# Altium schematic sheet Mag_Enc_Sensors_muxed.SchDoc
size Letter; SheetNumber: 7; SheetTotal: 8
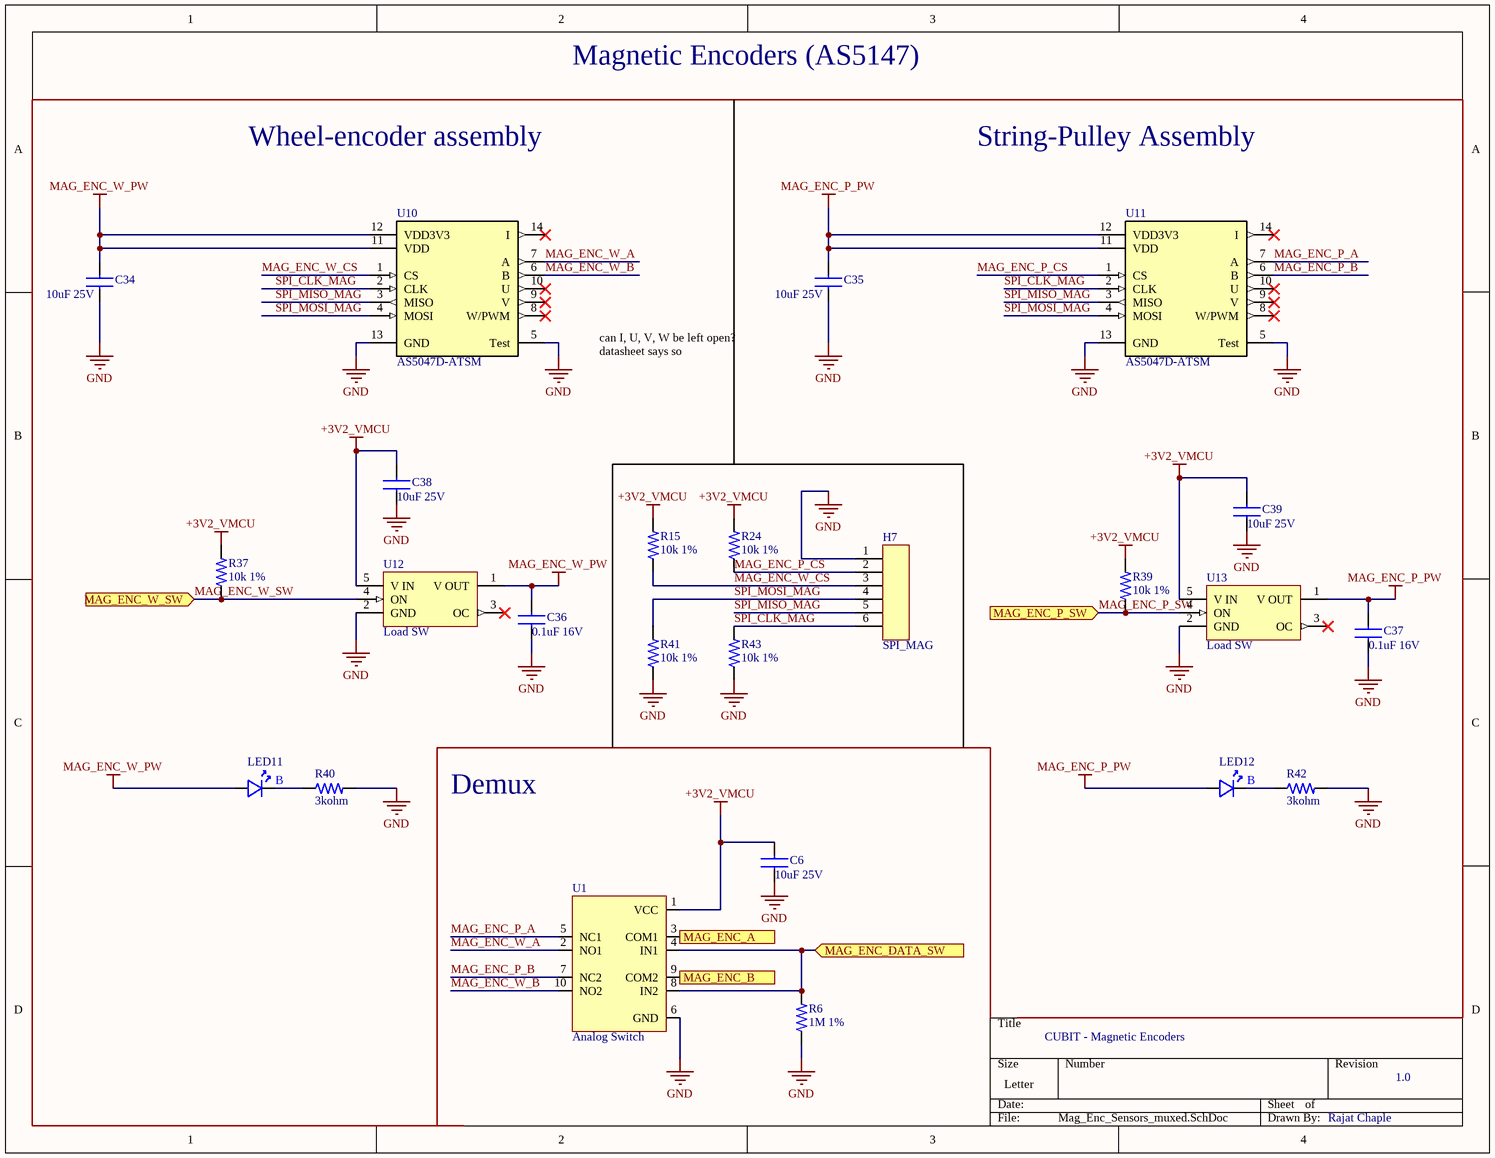
[diagram p0: Mag_Enc_Sensors_muxed.SchDoc]

## Parts
C6  10uF 25V  [CAP_0805_02X125]
C34  10uF 25V  [CAP_0805_02X125]
C35  10uF 25V  [CAP_0805_02X125]
C36  0.1uF 16V  [CAP_0603_1MM]
C37  0.1uF 16V  [CAP_0603_1MM]
C38  10uF 25V  [CAP_0805_02X125]
C39  10uF 25V  [CAP_0805_02X125]
H7  SPI_MAG  [6_PIN_100MIL]
LED11  150060BS75000  [LED_0603_RED_WL-SMCW]  (value not drawn)
LED12  150060BS75000  [LED_0603_RED_WL-SMCW]  (value not drawn)
R6  1M 1%  [2_Chip_0603_RMCF]
R15  10k 1%  [2_Chip_0603_RMCF]
R24  10k 1%  [2_Chip_0603_RMCF]
R37  10k 1%  [2_Chip_0603_RMCF]
R39  10k 1%  [2_Chip_0603_RMCF]
R40  3kohm  [CAP_0603_1MM]
R41  10k 1%  [2_Chip_0603_RMCF]
R42  3kohm  [CAP_0603_1MM]
R43  10k 1%  [2_Chip_0603_RMCF]
U1  Analog Switch  [TSSOP50P490X110-10N]
U10  AS5047D-ATSM  [14-TSOP_5x4_4]
U11  AS5047D-ATSM  [14-TSOP_5x4_4]
U12  Load SW  [SOT65P210X110-5N]
U13  Load SW  [SOT65P210X110-5N]

## Ports
MAG_ENC_A (out), MAG_ENC_B (out), MAG_ENC_DATA_SW (in), MAG_ENC_P_SW (in), MAG_ENC_W_SW (in)

## Nets
+3V2_VMCU: C6.1 C38.1 C39.1 R15.2 R24.2 R37.2 R39.2 U1.1(VCC) U12.5(V_IN) U13.5(V_IN)
GND: C6.2 C34.2 C35.2 C36.2 C37.2 C38.2 C39.2 H7.1 R6.1 R40.2 R41.1 R42.2 R43.1 U1.6(GND) U10.5(Test) U10.13(GND) U11.5(Test) U11.13(GND) U12.2(GND) U13.2(GND)
MAG_ENC_P_PW: C35.1 C37.1 LED12.A U11.11(VDD) U11.12(VDD3V3) U13.1(V_OUT)
MAG_ENC_W_PW: C34.1 C36.1 LED11.A U10.11(VDD) U10.12(VDD3V3) U12.1(V_OUT)
MAG_ENC_A: U1.3(COM1) ; port MAG_ENC_A
MAG_ENC_B: U1.9(COM2) ; port MAG_ENC_B
MAG_ENC_DATA_SW: R6.2 U1.4(IN1) U1.8(IN2) ; port MAG_ENC_DATA_SW
MAG_ENC_P_A: U1.5(NC1) U11.7(A)
MAG_ENC_P_B: U1.7(NC2) U11.6(B)
MAG_ENC_P_CS: H7.2 R24.1 U11.1(CS)
MAG_ENC_P_SW: R39.1 U13.4(ON) ; port MAG_ENC_P_SW
MAG_ENC_W_A: U1.2(NO1) U10.7(A)
MAG_ENC_W_B: U1.10(NO2) U10.6(B)
MAG_ENC_W_CS: H7.3 R15.1 U10.1(CS)
MAG_ENC_W_SW: R37.1 U12.4(ON) ; port MAG_ENC_W_SW
SPI_CLK_MAG: H7.6 R43.2 U10.2(CLK) U11.2(CLK)
SPI_MISO_MAG: H7.5 U10.3(MISO) U11.3(MISO)
SPI_MOSI_MAG: H7.4 R41.2 U10.4(MOSI) U11.4(MOSI)
NetLED11_C: LED11.C R40.1
NetLED12_C: LED12.C R42.1

Not connected (* = marked no-connect by the designer): U10 8(W/PWM)* 9(V)* 10(U)* 14(I)*; U11 8(W/PWM)* 9(V)* 10(U)* 14(I)*; U12 3(OC)*; U13 3(OC)*

## Notes on the sheet
- Magnetic Encoders (AS5147)
- Wheel-encoder assembly
- String-Pulley Assembly
- can I, U, V, W be left open?
  datasheet says so
- Demux
- CUBIT - Magnetic Encoders
- 1.0
- Rajat Chaple
- (in symbol 150060BS75000) B

## Library data of the parts
C6 C34 C35 C38 C39 = GRM21BR61E106KA73K: Cap 0805 25 V 10 uF ±20% Tolerance X5R Monolithic Ceramic Chip Capacitor; Manufacturer: Murata; Tolerance: 10%; Supplier 1: Digi-Key; Manufacturer Part Number: GRM21BR61E106KA73K; RoHS: Yes; Category: Ceramic Capacitors; Stock 1: 1875; Pricing 1: 1=0.23000, 10=0.15700, 50=0.09400, 100=0.07940, 500=0.05434, 1000=0.04807, 2500=0.04598, 5000=0.04180 (USD); Mount: Surface Mount; Case/Package: 0805; Weight: 0.000335oz; Min Operating Temperature: -55°C; Max Operating Temperature: 85°C; Packaging: Tape and Reel; Capacitance: 10uF; Voltage Rating: 25V; Package Quantity: 10000; Dielectric: X5R; Voltage Rating (DC): 25V; Length: 0.079inch; Width: 0.049inch; Thickness: 0.055inch; RoHS Compliant: Yes; ComponentLink1URL: http://www.mouser.com/ds/2/281/c02e-2905.pdf?src-supplier=Mouser; ComponentLink1Description: http://www.mouser.com/ds/2/281/c02e-2905.pdf?src-supplier=Mouser; ComponentLink2URL: http://search.murata.co.jp/Ceramy/image/img/A01X/G101/ENG/GRM21BR61E106KA73-01.pdf?src-supplier=Digi-Key; ComponentLink2Description: http://search.murata.co.jp/Ceramy/image/img/A01X/G101/ENG/GRM21BR61E106KA73-01.pdf?src-supplier=Digi-Key; ComponentLink3URL: https://search.murata.co.jp/Ceramy/image/img/A01X/G101/ENG/GRM21BR61E106KA73-01.pdf?src-supplier=Digi-Key; ComponentLink3Description: https://search.murata.co.jp/Ceramy/image/img/A01X/G101/ENG/GRM21BR61E106KA73-01.pdf?src-supplier=Digi-Key
C36 C37 = C0805C104K4RACAUTO: Cap Ceramic 0.1uF 16V X7R 10% SMD 0603 125°C Paper T/R; Manufacturer: KEMET; Capacitance: 100nF; Supplier 1: Digi-Key; Manufacturer Part Number: C0805C104K4RACAUTO; RoHS: Yes; Category: Ceramic Capacitors; Stock 1: 15900; Pricing 1: 1=0.24000, 10=0.16200, 50=0.09700, 100=0.08190, 500=0.05606, 1000=0.04959 (USD); Case/Package: 0805; Min Operating Temperature: -55°C; Max Operating Temperature: 125°C; Tolerance: 10%; Packaging: Tape and Reel; Dielectric: X7R; Length: 2mm; Depth: 1.25mm; RoHS Compliant: Yes; ComponentLink1URL: http://components.arrow.com/part/dataview/0323_00325188?src-supplier=Arrow+Europe; ComponentLink1Description: http://components.arrow.com/part/dataview/0323_00325188?src-supplier=Arrow+Europe
H7 = 6_pin_connector
LED11 LED12 = 150060BS75000: Led, Blue, 470 Nm, 3.2 V, 30 Ma, 145 Mcd Rohs Compliant: Yes; Manufacturer: Wurth Electronics; Luminous Intensity: 145mcd; Forward Current: 30mA; Forward Voltage: 3.2V; Wavelength: 470nm; Viewing Angle: 140°; Lens Style: Clear,Rectangular; Test Current: 20mA; Supplier 1: Digi-Key; Manufacturer Part Number: 150060BS75000; RoHS: Yes; Category: LEDs; Stock 1: 351; Pricing 1: 1=0.16000, 50=0.15000, 100=0.12900, 500=0.11200 (USD); Mount: Surface Mount; Case/Package: 0603; Color: Blue; Case Code (Metric): 1608; Case Code (Imperial): 0603; Min Operating Temperature: -40°C; Max Operating Temperature: 85°C; Package Quantity: 4000; Packaging: Cut Tape; Dominant Wavelength: 470nm; Length: 1.6mm; Width: 0.8mm; Height: 0.7mm; REACH SVHC: Unknown; RoHS Compliant: Yes; ComponentLink1URL: https://datasheet.ciiva.com/29563/150060bs75000-29563034.pdf?src-supplier=Digi-Key; ComponentLink1Description: https://datasheet.ciiva.com/29563/150060bs75000-29563034.pdf?src-supplier=Digi-Key; ComponentLink2URL: https://datasheet.ciiva.com/29279/759426-da-01-en-chipled-0603-w-kl-blau-150060bs75000-29279193.pdf?src-supplier=Conrad; ComponentLink2Description: https://datasheet.ciiva.com/29279/759426-da-01-en-chipled-0603-w-kl-blau-150060bs75000-29279193.pdf?src-supplier=Conrad; ComponentLink3URL: https://datasheet.ciiva.com/29563/150060bs75000-29563036.pdf?src-supplier=Digi-Key; ComponentLink3Description: https://datasheet.ciiva.com/29563/150060bs75000-29563036.pdf?src-supplier=Digi-Key; ComponentLink4URL: https://datasheet.ciiva.com/29563/150060bs75000-29563035.pdf?src-supplier=Digi-Key; ComponentLink4Description: https://datasheet.ciiva.com/29563/150060bs75000-29563035.pdf?src-supplier=Digi-Key; ComponentLink5URL: https://datasheet.ciiva.com/22656/1911343-22656939.pdf?src-supplier=Element14; ComponentLink5Description: https://datasheet.ciiva.com/22656/1911343-22656939.pdf?src-supplier=Element14; ComponentLink6URL: https://datasheet.ciiva.com/48430/150060bs75000-eng-tds-48430039.pdf?src-supplier=Distrelec; ComponentLink6Description: https://datasheet.ciiva.com/48430/150060bs75000-eng-tds-48430039.pdf?src-supplier=Distrelec
R6 = RMCF0603FT1M00: Res 1M Ohm 1% 1/10W ±100ppm/°C Molded SMD Paper T/R; Manufacturer: Stackpole Electronics; Resistance: 1MR; Power Rating: 100mW; Working Voltage: 75V; Supplier 1: Digi-Key; Manufacturer Part Number: RMCF0603FT1M00; RoHS: Yes; Category: Chip SMD Resistors; Stock 1: 2136203; Pricing 1: 1=0.10000, 10=0.01700, 100=0.00680, 1000=0.00305, 2500=0.00264 (USD); Mount: Surface Mount; Case/Package: 0603; Case Code (Metric): 1608; Case Code (Imperial): 0603; Contact Plating: Tin,Matte; Min Operating Temperature: -55°C; Max Operating Temperature: 155°C; Tolerance: 1%; Packaging: Tape and Reel; Resistor Type: Thick Film; Number of Terminations: 2; Max Power Dissipation: 100mW; Temperature Coefficient: 100ppm/°C; Features: Automotive AEC-Q200; Series: RMCF; Construction: Rectangular; Technology: THICK FILM; Length: 1.55mm; Width: 0.031inch; Height: 0.022inch; Depth: 0.8mm; Radiation Hardening: No; Military Standard: Not; Lead Free: Lead Free; RoHS Compliant: Yes; ComponentLink1URL: https://datasheet.ciiva.com/15193/getdatasheetpartid-363151-15193451.pdf?src-supplier=Verical; ComponentLink1Description: https://datasheet.ciiva.com/15193/getdatasheetpartid-363151-15193451.pdf?src-supplier=Verical
R15 R24 R37 R39 R41 R43 = RMCF0603FT10K0: Res 10K Ohm 1% 1/10W ±100ppm/°C Molded SMD SMD Paper T/R; Manufacturer: Stackpole Electronics; Resistance: 10kR; Power Rating: 100mW; Supplier 1: Digi-Key; Manufacturer Part Number: RMCF0603FT10K0; RoHS: Yes; Category: Chip SMD Resistors; Stock 1: 15114443; Pricing 1: 5000=0.00218 (USD); Mount: Surface Mount; Case/Package: 0603; Case Code (Metric): 1608; Case Code (Imperial): 0603; Contact Plating: Tin,Matte; Size Code: 0603; Min Operating Temperature: -55°C; Max Operating Temperature: 155°C; Tolerance: 1%; Packaging: Tape and Reel; Resistor Type: Thick Film; Number of Terminations: 2; Max Power Dissipation: 100mW; Temperature Coefficient: 100ppm/°C; Features: Automotive AEC-Q200; Series: RMCF; Construction: Rectangular; Length: 1.55mm; Width: 0.031inch; Height: 0.022inch; Depth: 0.8mm; Radiation Hardening: No; Military Standard: Not; Lead Free: Lead Free; RoHS Compliant: Yes; ComponentLink1URL: http://components.arrow.com/part/dataview/43747082S6756917N1174?src-supplier=Arrow+Electronics; ComponentLink1Description: http://components.arrow.com/part/dataview/43747082S6756917N1174?src-supplier=Arrow+Electronics; ComponentLink2URL: https://www.seielect.com/catalog/SEI-RMCF_RMCP.pdf?src-supplier=Avnet; ComponentLink2Description: https://www.seielect.com/catalog/SEI-RMCF_RMCP.pdf?src-supplier=Avnet; ComponentLink3URL: http://www.seielect.com/catalog/sei-rmc.pdf?src-supplier=Future+Electronics; ComponentLink3Description: http://www.seielect.com/catalog/sei-rmc.pdf?src-supplier=Future+Electronics; ComponentLink4URL: https://www.verical.com/server-webapp/html/getDatasheet?partID=360913&src-supplier=Verical; ComponentLink4Description: https://www.verical.com/server-webapp/html/getDatasheet?partID=360913&src-supplier=Verical; ComponentLink5URL: https://www.seielect.com/catalog/sei-rmcf_rmcp.pdf?src-supplier=Digi-Key; ComponentLink5Description: https://www.seielect.com/catalog/sei-rmcf_rmcp.pdf?src-supplier=Digi-Key
R40 R42 = RC0603FR-073KL: Res 3000Ω ± 1.00% 0.1W ± 100ppm/℃ 0603; Manufacturer: Yageo; Tolerance: 1%; Resistance: 3kR; Power Rating: 100mW; Voltage Rating: 50V; Temperature Coefficient: 100ppm/°C; Supplier 1: Digi-Key; Manufacturer Part Number: RC0603FR-073KL; RoHS: Yes; Category: Chip SMD Resistors; Stock 1: 1079123; Pricing 1: 1=0.10000, 10=0.02400, 100=0.00970, 1000=0.00436, 2500=0.00378 (USD); Case/Package: 0603; Number of Pins: 2; Case Code (Imperial): 0603; Case Code (Metric): 1608; Size Code: 0603; Min Operating Temperature: -55°C; Max Operating Temperature: 155°C; Packaging: Tape and Reel; Termination: SMD/SMT; Resistor Type: Thick Film; Voltage Rating (DC): 50V; Features: Moisture Resistant; Series: RC; Max Power Dissipation: 100mW; Number of Terminations: 2; Construction: Rectangular; Resistance Tolerance: 1%; Length: 1.6mm; Width: 800um; Depth: 0.8mm; Military Standard: Not; Lead Free: Lead Free; RoHS Compliant: Yes; REACH SVHC: No SVHC; ComponentLink1URL: http://www.farnell.com/datasheets/2167052.pdf?src-supplier=Farnell; ComponentLink1Description: http://www.farnell.com/datasheets/2167052.pdf?src-supplier=Farnell; ComponentLink2URL: http://www.mouser.com/ds/2/447/RC0603-272842.pdf?src-supplier=Mouser; ComponentLink2Description: http://www.mouser.com/ds/2/447/RC0603-272842.pdf?src-supplier=Mouser; ComponentLink3URL: http://components.arrow.com/part/dataview/0323_00200942?src-supplier=Arrow+Europe; ComponentLink3Description: http://components.arrow.com/part/dataview/0323_00200942?src-supplier=Arrow+Europe; ComponentLink4URL: https://www.verical.com/server-webapp/html/getDatasheet?partID=135099&src-supplier=Verical; ComponentLink4Description: https://www.verical.com/server-webapp/html/getDatasheet?partID=135099&src-supplier=Verical; ComponentLink5URL: http://www.farnell.com/datasheets/2167052.pdf?src-supplier=Element14; ComponentLink5Description: http://www.farnell.com/datasheets/2167052.pdf?src-supplier=Element14; ComponentLink6URL: http://www.yageo.com/documents/recent/PYu-RC_Group_51_RoHS_L_10.pdf?src-supplier=Digi-Key; ComponentLink6Description: http://www.yageo.com/documents/recent/PYu-RC_Group_51_RoHS_L_10.pdf?src-supplier=Digi-Key; ComponentLink7URL: http://www.yageo.com/documents/recent/PYu-RC_Group_51_RoHS_L_9.pdf?src-supplier=Digi-Key; ComponentLink7Description: http://www.yageo.com/documents/recent/PYu-RC_Group_51_RoHS_L_9.pdf?src-supplier=Digi-Key; ComponentLink8URL: http://www.farnell.com/datasheets/1868787.pdf?src-supplier=Newark; ComponentLink8Description: http://www.farnell.com/datasheets/1868787.pdf?src-supplier=Newark; ComponentLink9URL: http://www.yageo.com/documents/recent/PYu-RC0603_51_RoHS_L_7.pdf?src-supplier=Future+Electronics; ComponentLink9Description: http://www.yageo.com/documents/recent/PYu-RC0603_51_RoHS_L_7.pdf?src-supplier=Future+Electronics
U1 = TS3A24159DGSR: SPDT, 2 Func, 2 Channel, PDSO10; Manufacturer: Texas Instruments; Package Body Material: Plastic; Number of Channels: 2; Off-state Isolation-Nom: 73dB; On-state Resistance Match-Nom: 20mR; On-state Resistance-Max (Ron): 450mR; Package Equivalence Code: TSSOP10,.19,20; Power Supplies: 1.8/3V; Signal Current-Max: 100mA; Supply Voltage-Max (Vsup): 1.95V; Supply Voltage-Min (Vsup): 1.65V; Supply Voltage-Nom (Vsup): 1.8V; Switching: BREAK-BEFORE-MAKEV; Switch-off Time-Max: 35ns; Switch-on Time-Max: 75ns; Qualification Status: Not Qualified; Supplier 1: Digikey; Manufacturer Part Number: TS3A24159DGSR; RoHS: Yes; Category: Interface ICs; Stock 1: 16494; Pricing 1: 1=1.3, 10=1.159, 25=1.1, 100=0.9036, 250=0.84472, 500=0.7465, 1000=0.58934 (USD); Package Code: TSSOP; Number of Pins: 10; Package Shape: Square; Terminal Finish: Nickel; Min Operating Temperature: -40°C; Max Operating Temperature: 85°C; JESD-609 Code: e4; Analog IC - Other Type: SPDT; JESD-30 Code: S-PDSO-G10; Moisture Sensitivity Level: 1; Number of Functions: 2; Package Style: SMALL OUTLINE, THIN PROFILE, SHRINK PITCHMeter; Peak Reflow Temperature (Cel): 260°C; Surface Mount: Yes; Terminal Form: Gull Wing; Terminal Position: DUAL; Length: 3mm; Width: 3mm; Height - Seated (Max): 1.1mm; Terminal Pitch: 0.5mm; Temperature Grade: INDUSTRIAL; Reach SVHC Compliant: Yes; RoHS Compliant: Yes; ComponentLink1URL: https://www.ti.com:443/lit/ds/symlink/ts3a24159.pdf?src-supplier=IHS+Markit; ComponentLink1Description: https://www.ti.com:443/lit/ds/symlink/ts3a24159.pdf?src-supplier=IHS+Markit; ComponentLink2URL: https://datasheet.ciiva.com/1671/ts3a24159-1671344.pdf?src-supplier=Digikey; ComponentLink2Description: https://datasheet.ciiva.com/1671/ts3a24159-1671344.pdf?src-supplier=Digikey; ComponentLink3URL: https://datasheet.ciiva.com/15127/getdatasheetpartid-225813-15127469.pdf?src-supplier=Verical; ComponentLink3Description: https://datasheet.ciiva.com/15127/getdatasheetpartid-225813-15127469.pdf?src-supplier=Verical; ComponentLink4URL: https://datasheet.ciiva.com/41461/001187304-da-01-en-ic-switch-dual-ts3a24159dgsr-msop-10-tid-41461680.pdf?src-supplier=Conrad; ComponentLink4Description: https://datasheet.ciiva.com/41461/001187304-da-01-en-ic-switch-dual-ts3a24159dgsr-msop-10-tid-41461680.pdf?src-supplier=Conrad; ComponentLink5URL: https://datasheet.ciiva.com/46411/1857382-46411531.pdf?src-supplier=Element14; ComponentLink5Description: https://datasheet.ciiva.com/46411/1857382-46411531.pdf?src-supplier=Element14; ComponentLink6URL: https://datasheet.ciiva.com/1671/ts3a24159-1671343.pdf?src-supplier=Digikey; ComponentLink6Description: https://datasheet.ciiva.com/1671/ts3a24159-1671343.pdf?src-supplier=Digikey; ComponentLink7URL: https://datasheet.ciiva.com/1671/ts3a24159-1671345.pdf?src-supplier=Digikey; ComponentLink7Description: https://datasheet.ciiva.com/1671/ts3a24159-1671345.pdf?src-supplier=Digikey
U10 U11 = AS5047D-ATSM: Manufacturer: Osram; Supplier 1: Digi-Key; Manufacturer Part Number: AS5047D-ATSM; RoHS: No; Category: Uncategorized; Stock 1: 16475; Pricing 1: 1=9.40000, 5=8.25000, 10=7.42500, 25=6.60000, 50=6.10500, 100=5.28000 (USD)
U12 U13 = TPS22942DCKR: 5.5-V, 0.1-A, 500-mΩ, load switch with current limit and active low enable 5-SC70 -40 to 85; Manufacturer: Texas Instruments; Number of Outputs: 1; Output Current: 200mA; Nominal Supply Current: 1uA; Max Output Current: 100mA; Max Supply Voltage: 5.5V; Min Supply Voltage: 1.62V; Interface: On/Off; On-State Resistance: 500mR; Turn-On Delay Time: 60us; Turn-Off Delay Time: 30us; Max Supply Current: 80uA; Max Power Dissipation: 1.22mW; Quiescent Current: 40uA; Fault Protection: Over Temperature; Output Configuration: High Side; Supplier 1: Digi-Key; Manufacturer Part Number: TPS22942DCKR; RoHS: Yes; Category: Hot Swap Controllers; Stock 1: 1111; Pricing 1: 1=1.24000, 10=1.10700, 25=1.05080, 100=0.86310, 250=0.80676, 500=0.71296, 1000=0.61950 (USD); Case/Package: SC; Number of Pins: 5; Weight: 8.8E-05oz; Min Operating Temperature: -40°C; Max Operating Temperature: 85°C; Packaging: Tape and Reel; Number of Inputs: 1; Package Quantity: 3000; Max Input Voltage: 5.5V; Min Input Voltage: 1.62V; Termination: SMD/SMT; Min Current Limit: 100mA; Number of Channels: 1; Radiation Hardening: No; REACH SVHC: No SVHC; Lead Free: Lead Free; RoHS Compliant: Yes; ComponentLink1URL: https://datasheet.ciiva.com/1962/tps22945-1962436.pdf?src-supplier=Digi-Key; ComponentLink1Description: https://datasheet.ciiva.com/1962/tps22945-1962436.pdf?src-supplier=Digi-Key; ComponentLink2URL: https://datasheet.ciiva.com/15103/getdatasheetpartid-122296-15103873.pdf?src-supplier=Verical; ComponentLink2Description: https://datasheet.ciiva.com/15103/getdatasheetpartid-122296-15103873.pdf?src-supplier=Verical; ComponentLink3URL: https://datasheet.ciiva.com/1512/1840307-1512708.pdf?src-supplier=Element14; ComponentLink3Description: https://datasheet.ciiva.com/1512/1840307-1512708.pdf?src-supplier=Element14; ComponentLink4URL: https://datasheet.ciiva.com/1963/tps22942-1963503.pdf?src-supplier=Digi-Key; ComponentLink4Description: https://datasheet.ciiva.com/1963/tps22942-1963503.pdf?src-supplier=Digi-Key; ComponentLink5URL: https://datasheet.ciiva.com/1963/tps22942-1963502.pdf?src-supplier=Digi-Key; ComponentLink5Description: https://datasheet.ciiva.com/1963/tps22942-1963502.pdf?src-supplier=Digi-Key; ComponentLink6URL: https://datasheet.ciiva.com/3233/tps22945-3233582.pdf?src-supplier=Avnet; ComponentLink6Description: https://datasheet.ciiva.com/3233/tps22945-3233582.pdf?src-supplier=Avnet; ComponentLink7URL: https://datasheet.ciiva.com/26074/tps22945-26074375.pdf?src-supplier=Avnet+Europe; ComponentLink7Description: https://datasheet.ciiva.com/26074/tps22945-26074375.pdf?src-supplier=Avnet+Europe